# Altium schematic sheet Amp.SchDoc
size A3; SheetNumber: 2; SheetTotal: 6
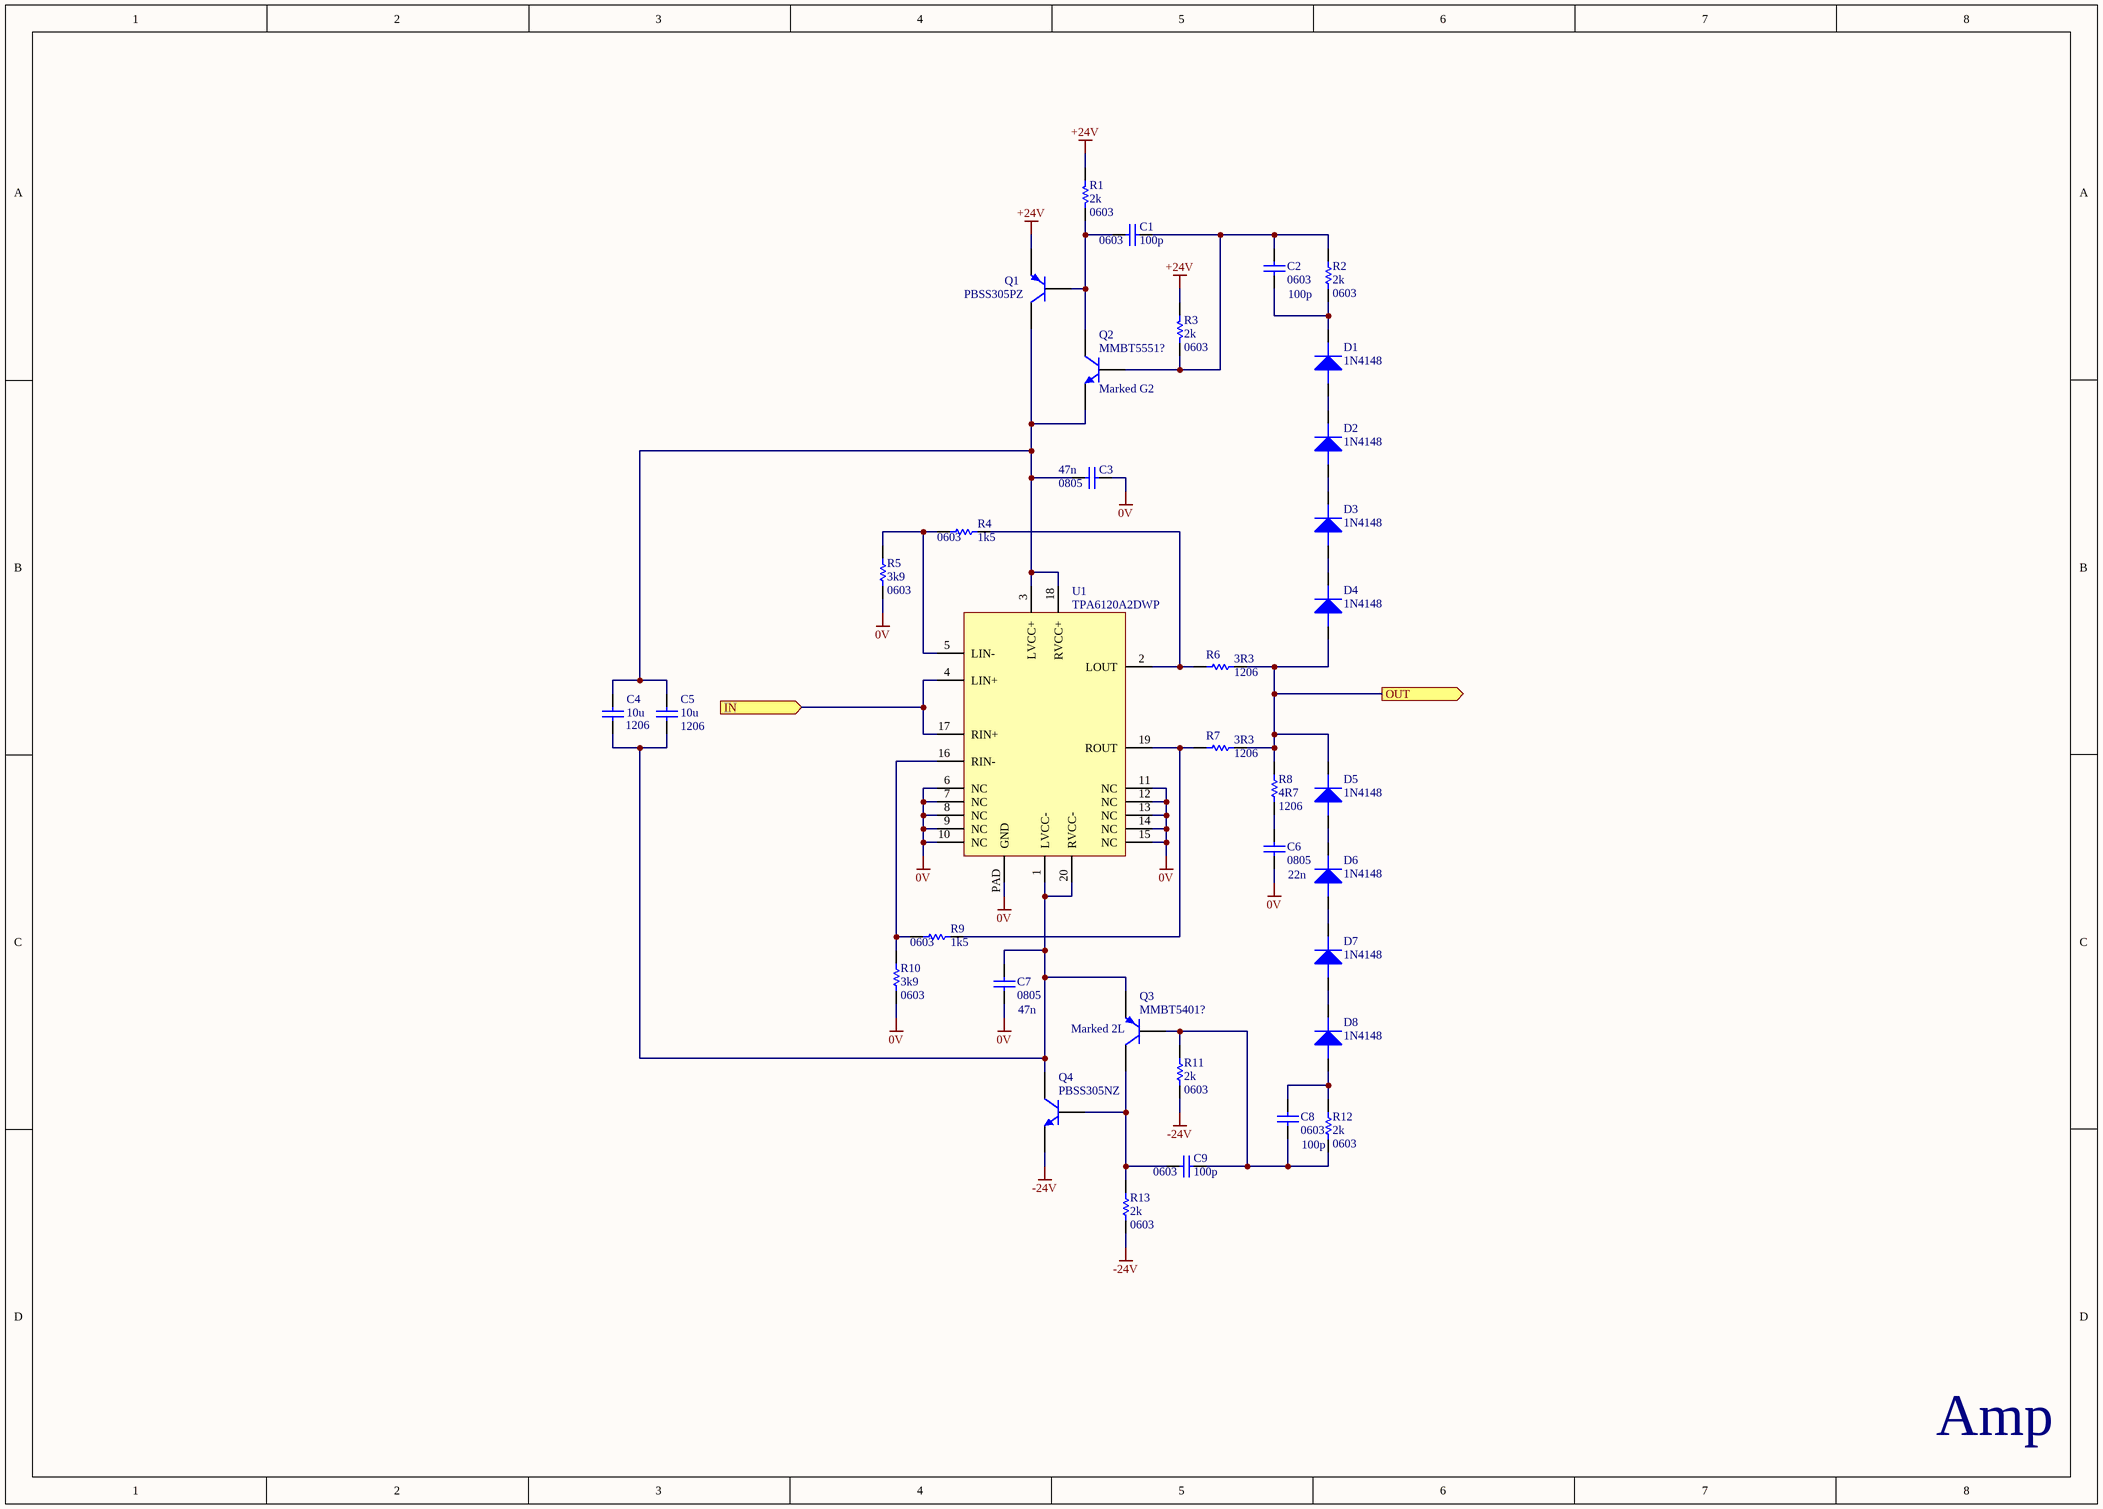
[diagram p0: Amp.SchDoc]

## Parts
C1  value 100p  Package: 0603  [CAPC1608X09N]  (hidden comment: C_MLCC_0603)
C2  value 100p  Package: 0603  [CAPC1608X09N]  (hidden comment: C_MLCC_0603)
C3  value 47n  Package: 0805  [CAPC2012X14N]  (hidden comment: C_MLCC_0805)
C4  value 10u  Package: 1206  [C_NP_1206]  (hidden comment: C_MLCC_1206)
C5  value 10u  Package: 1206  [C_NP_1206]  (hidden comment: C_MLCC_1206)
C6  value 22n  Package: 0805  [CAPC2012X14N]  (hidden comment: C_MLCC_0805)
C7  value 47n  Package: 0805  [CAPC2012X14N]  (hidden comment: C_MLCC_0805)
C8  value 100p  Package: 0603  [CAPC1608X09N]  (hidden comment: C_MLCC_0603)
C9  value 100p  Package: 0603  [CAPC1608X09N]  (hidden comment: C_MLCC_0603)
D1  1N4148
D2  1N4148
D3  1N4148
D4  1N4148
D5  1N4148
D6  1N4148
D7  1N4148
D8  1N4148
Q1  PBSS305PZ  [SOT230P700X165-4N]
Q2  value MMBT5551?  [SOT95P230X110-3N]  (hidden comment: MMBT5551)
Q3  value MMBT5401?  [SOT95P230X110-3N]  (hidden comment: MMBT5401)
Q4  PBSS305NZ  [SOT230P700X165-4N]
R1  value 2k  Package: 0603  [RESC1608X06N]  (hidden comment: R)
R2  value 2k  Package: 0603  [RESC1608X06N]  (hidden comment: R)
R3  value 2k  Package: 0603  [RESC1608X06N]  (hidden comment: R)
R4  value 1k5  Package: 0603  [RESC1608X06N]  (hidden comment: R)
R5  value 3k9  Package: 0603  [RESC1608X06N]  (hidden comment: R)
R6  value 3R3  Package: 1206  [RESC3116X06N]  (hidden comment: R)
R7  value 3R3  Package: 1206  [RESC3116X06N]  (hidden comment: R)
R8  value 4R7  Package: 1206  [RESC3116X06N]  (hidden comment: R)
R9  value 1k5  Package: 0603  [RESC1608X06N]  (hidden comment: R)
R10  value 3k9  Package: 0603  [RESC1608X06N]  (hidden comment: R)
R11  value 2k  Package: 0603  [RESC1608X06N]  (hidden comment: R)
R12  value 2k  Package: 0603  [RESC1608X06N]  (hidden comment: R)
R13  value 2k  Package: 0603  [RESC1608X06N]  (hidden comment: R)
U1  TPA6120A2DWP  [SOIC127P1040X265_HS-21N]

## Ports
IN (in, see Top[2B]), OUT (out, see Top[3B])

## Nets
0V: C3.1 C6.1 C7.1 R5.2 R10.2 U1.6(NC) U1.7(NC) U1.8(NC) U1.9(NC) U1.10(NC) U1.11(NC) U1.12(NC) U1.13(NC) U1.14(NC) U1.15(NC) U1.PAD(GND)
+24V: Q1.E R1.2 R3.2
-24V: Q4.E R11.2 R13.2
IN: U1.4(LIN+) U1.17(RIN+) ; port IN
OUT: D4.A D5.K R6.2 R7.2 R8.2 ; port OUT
NetC1_1: C1.1 Q1.B Q2.C R1.1
NetC1_2: C1.2 C2.1 Q2.B R2.1 R3.1
NetC2_2: C2.2 D1.K R2.2
NetC3_2: C3.2 C4.1 C5.1 Q1.C Q2.E U1.3(LVCC+) U1.18(RVCC+)
NetC4_2: C4.2 C5.2 C7.2 Q3.E Q4.C U1.1(LVCC-) U1.20(RVCC-)
NetC6_2: C6.2 R8.1
NetC8_1: C8.1 D8.A R12.1
NetC8_2: C8.2 C9.2 Q3.B R11.1 R12.2
NetC9_1: C9.1 Q3.C Q4.B R13.1
NetD1_A: D1.A D2.K
NetD2_A: D2.A D3.K
NetD3_A: D3.A D4.K
NetD5_A: D5.A D6.K
NetD6_A: D6.A D7.K
NetD7_A: D7.A D8.K
NetR4_1: R4.1 R6.1 U1.2(LOUT)
NetR4_2: R4.2 R5.1 U1.5(LIN-)
NetR7_1: R7.1 R9.1 U1.19(ROUT)
NetR9_2: R9.2 R10.1 U1.16(RIN-)

## Notes on the sheet
- (near Q2) Marked G2
- (near Q3) Marked 2L
- Amp

## Library data of the parts
C1 C2 C8 C9 = C_MLCC_0603: Generic MLCC 0603 Non Polarized Capacitor; Category: Capacitor; Sub-Category: MLCC; Manufacturer: Generic; Notes: *
C3 C6 C7 = C_MLCC_0805: Generic MLCC 0805 Non Polarized Capacitor; Category: Capacitor; Sub-Category: MLCC; Manufacturer: Generic; Notes: *
C4 C5 = C_MLCC_1206: Generic MLCC Non Polarized Capacitor 1206; Manufacturer: Generic; Category: Capacitor; Sub-Category: MLCC; Notes: *
D1-D8 = 1N4148: Generic small signal diode; Manufacturer Part Number: BAT48ZFILM; Number of Elements: 1; Rep Pk Reverse Voltage-Max: 40V; Package Body Material: Plastic; Diode Type: RECTIFIER; Forward Voltage-Max (VF): 250mV; Non-rep Pk Forward Current-Max: 2A; Diode Element Material: SILICON; Time @ Peak Reflow Temperature-Max (s): 30s; Max Output Current: 350mA; Qualification Status: Not Qualified; Peak Reflow Temperature (Cel): 260°C; Max Operating Temperature: 150°C; Terminal Position: DUAL; Technology: SCHOTTKY; JESD-30 Code: R-PDSO-G2; Category: Diode; Surface Mount: Yes; RoHS Compliant: Yes; Manufacturer: Generic; Number of Pins: 2; Sub-Category: Signal; Terminal Form: Gull Wing; REACH SVHC: Yes; JESD-609 Code: e3; Package Shape: Rectangular; Package Style: SMALL OUTLINEMeter; Terminal Finish: Tin; Component Type: Standard_Diode; Value: 1N4148
Q1 = PBSS305PZ: 80 V, 5.1 A PNP low VCEsat (BISS) transistor; pin to pad: B>1 C>2+TAB E>3; Manufacturer: NXP; Manufacturer Part Number: DZT2222A-13; Collector-emitter Voltage-Max: 40V; Time @ Peak Reflow Temperature-Max (s): 40s; Number of Elements: 1; Case Connection: COLLECTOR; Transistor Application: SWITCHING; Polarity/Channel Type: NPN; Package Body Material: Plastic; Turn-on Time-Max (ton): 35ns; Power Dissipation-Max (Abs): 1W; DC Current Gain-Min (hFE): 40; Max Collector Current: 600mA; Transistor Element Material: SILICON; Transition Frequency-Nom (fT): 300MHz; Qualification Status: Not Qualified; Turn-off Time-Max (toff): 285ns; Max Operating Temperature: 150°C; JESD-609 Code: e3; Moisture Sensitivity Level: 1; Sub-Category: BJT; JESD-30 Code: R-PDSO-G4; RoHS Compliant: Yes; Surface Mount: Yes; REACH SVHC: Yes; Terminal Finish: Tin; Terminal Form: Gull Wing; Package Shape: Rectangular; Number of Pins: 4; Package Style: SMALL OUTLINEMeter; Category: Transistor; Peak Reflow Temperature (Cel): 260°C; Terminal Position: DUAL; Component Type: Standard_Transistor; Package: SOT223-4; Value: PBSS305PZ
Q2 = MMBT5551: NPN General-Purpose / Amplifier; pin to pad: B>1 C>3 E>2; Manufacturer: On Semi; Manufacturer Part Number: MMBT3904VL; Package Body Material: Plastic; JEDEC-95 Code: TO-236AB; Transistor Application: SWITCHING; Max Collector Current: 200mA; DC Current Gain-Min (hFE): 30; Turn-on Time-Max (ton): 70ns; Turn-off Time-Max (toff): 250ns; Transistor Element Material: SILICON; Number of Elements: 1; Transition Frequency-Nom (fT): 300MHz; Collector-emitter Voltage-Max: 40V; Package Shape: Rectangular; JESD-30 Code: R-PDSO-G3; Number of Pins: 3; REACH SVHC: Yes; Sub-Category: BJT; RoHS Compliant: Yes; Terminal Position: DUAL; Surface Mount: Yes; Terminal Form: Gull Wing; Package Style: SMALL OUTLINEMeter; Polarity/Channel Type: NPN; Category: Transistor; Component Type: Standard_Transistor
Q3 = MMBT5401: PNP Epitaxial Silicon Transistor; pin to pad: B>1 C>3 E>2; Manufacturer: On Semi; Manufacturer Part Number: MMBT3904VL; Package Body Material: Plastic; JEDEC-95 Code: TO-236AB; Transistor Application: SWITCHING; Max Collector Current: 200mA; DC Current Gain-Min (hFE): 30; Turn-on Time-Max (ton): 70ns; Turn-off Time-Max (toff): 250ns; Number of Elements: 1; Polarity/Channel Type: NPN; Transition Frequency-Nom (fT): 300MHz; Collector-emitter Voltage-Max: 40V; Package Shape: Rectangular; JESD-30 Code: R-PDSO-G3; Number of Pins: 3; REACH SVHC: Yes; Sub-Category: BJT; RoHS Compliant: Yes; Transistor Element Material: SILICON; Terminal Position: DUAL; Surface Mount: Yes; Terminal Form: Gull Wing; Package Style: SMALL OUTLINEMeter; Category: Transistor; Component Type: Standard_Transistor
Q4 = PBSS305NZ: 80 V, 5.1 A NPN low VCEsat (BISS) transistor; pin to pad: B>1 C>2+TAB E>3; Manufacturer: NXP; Manufacturer Part Number: DZT2222A-13; Collector-emitter Voltage-Max: 40V; Time @ Peak Reflow Temperature-Max (s): 40s; Number of Elements: 1; Case Connection: COLLECTOR; Transistor Application: SWITCHING; Package Body Material: Plastic; Turn-on Time-Max (ton): 35ns; Power Dissipation-Max (Abs): 1W; DC Current Gain-Min (hFE): 40; Max Collector Current: 600mA; Transistor Element Material: SILICON; Transition Frequency-Nom (fT): 300MHz; Qualification Status: Not Qualified; Turn-off Time-Max (toff): 285ns; Max Operating Temperature: 150°C; JESD-609 Code: e3; Moisture Sensitivity Level: 1; Sub-Category: BJT; JESD-30 Code: R-PDSO-G4; RoHS Compliant: Yes; Surface Mount: Yes; REACH SVHC: Yes; Polarity/Channel Type: NPN; Terminal Finish: Tin; Terminal Form: Gull Wing; Package Shape: Rectangular; Number of Pins: 4; Package Style: SMALL OUTLINEMeter; Category: Transistor; Peak Reflow Temperature (Cel): 260°C; Terminal Position: DUAL; Component Type: Standard_Transistor; Package: SOT223-4; Value: PBSS305NZ
R1-R5 R9-R13 = R_0603: Generic 0603 Single Resistor; Manufacturer: Generic; Category: Resistor; Sub-Category: SMD; Notes: *
R6-R8 = R_1206: Generic 1206 Single Resistor; Manufacturer: Generic; Category: Resistor; Sub-Category: SMD; Notes: *
U1 = TPA6120A2DWP: Audio Amplifier, 1.5W, 2 Channel(s), 1 Func, SOIC20; Manufacturer: Texas Instruments; Manufacturer Part Number: TPA6120A2RGYT; Category: IC; JESD-609 Code: e4; Sub-Category: Audio; Moisture Sensitivity Level: 2; Terminal Finish: Nickel; REACH SVHC: Yes; Consumer IC Type: AUDIO AMPLIFIER; RoHS Compliant: Yes; Peak Reflow Temperature (Cel): 260°C; Component Type: Standard_IC_OpAmp; Package: SOIC20; Value: TPA6120A2DWP